# Altium schematic sheet supply1.SchDoc: foxBMS BMS-Master
size A3; DocumentNumber: 3; SheetNumber: 3; SheetTotal: 24; Author: Fraunhofer IISB foxBMS Team; REL-DATE: 2017-05-16; VERSION: 1.0.2; SheetDescription: Supply for MCU1 and peripherals
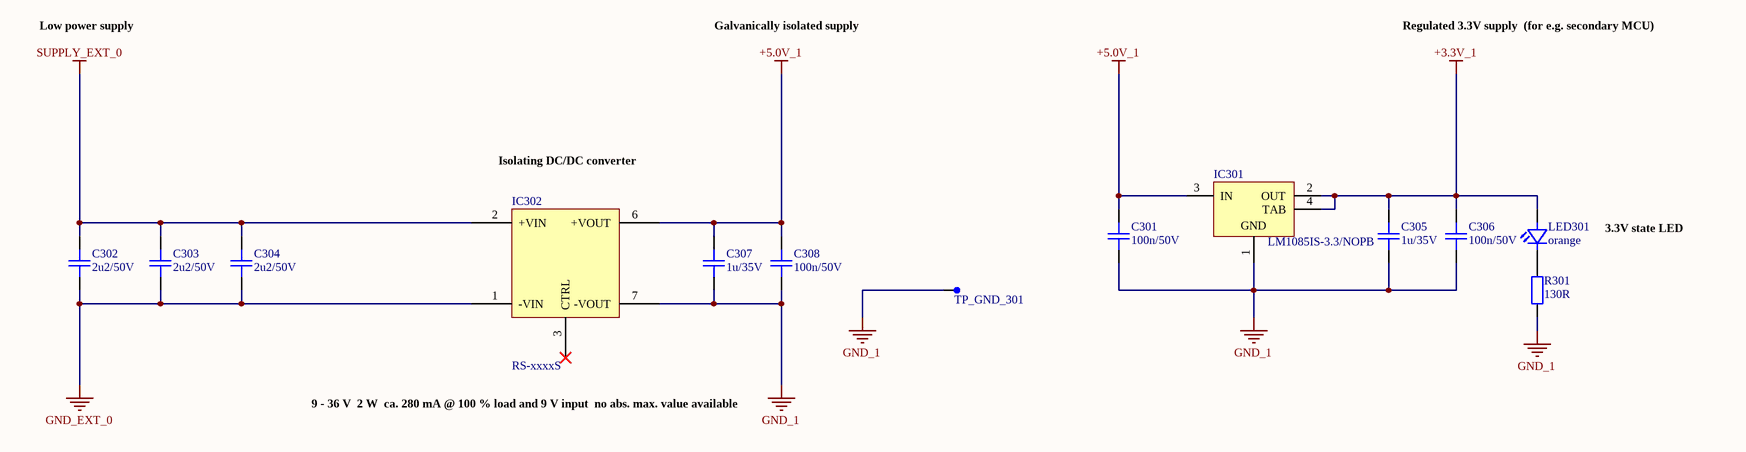
[diagram p0: supply1.SchDoc]

## Parts
C301  100n/50V  [CAPC1608X08N]
C302  2u2/50V  [CAPC2012X14N]
C303  2u2/50V  [CAPC2012X14N]
C304  2u2/50V  [CAPC2012X14N]
C305  1u/35V  [CAPC1608X08N]
C306  100n/50V  [CAPC1608X08N]
C307  1u/35V  [CAPC1608X08N]
C308  100n/50V  [CAPC1608X08N]
IC301  LM1085IS-3.3/NOPB  [KTT0003B_N]
IC302  RS-xxxxS  [RECOM_RS-S_D]
LED301  orange  [LEDC1608X07N]
R301  130R  [RESC1608X05N]
TP_GND_301  Testpoint_Round  [Testpoint_D1V]  (value not drawn)  (no BOM)

## Nets
+3.3V_1: C305.1 C306.1 IC301.2(OUT) IC301.4(TAB) LED301.2(A)
+5.0V_1: C301.1 C307.1 C308.1 IC301.3(IN) IC302.6(+VOUT)
GND_1: C301.2 C305.2 C306.2 C307.2 C308.2 IC301.1(GND) IC302.7(-VOUT) R301.2 TP_GND_301.1
GND_EXT_0: C302.2 C303.2 C304.2 IC302.1(-VIN)
SUPPLY_EXT_0: C302.1 C303.1 C304.1 IC302.2(+VIN)
NetLED301_1: LED301.1(C) R301.1

Not connected (* = marked no-connect by the designer): IC302 3(CTRL)*

## Notes on the sheet
- Low power supply
- Galvanically isolated supply
- Regulated 3.3V supply
  (for e.g. secondary MCU)
- Isolating DC/DC converter
- 3.3V state LED
- 9 - 36 V
  2 W
  ca. 280 mA @ 100 % load and 9 V input
  no abs. max. value available
- Fraunhofer IISB
- Schottkystr. 10
- developed by:
- 91058 Erlangen
- Germany
- Author
- Project
- License
- Description
- File
- Version
- Release Date
- Sheet
- www.foxbms.org
- www.iisb.fraunhofer.de
- foxBMS Team
- /

## Library data of the parts
C301 C306 C308 = gen_C_ceramic_100n_50V_X7R_0603: MLCC; Capacitance: 100n; Rated Voltage: 50V; Dielectric: X7R; Case EIA: 0603; Case Metric: 1608; PnP Package: C_0603_10; PnP Value: 100n/50V/X7R; PnP equipped: x; Automotive Qualified: False; Part Number: gen_C_ceramic_100n_50V_X7R_0603; Supplier 1: Farnell; Supplier Part Number 1: 2525267; Supplier 2: Digikey; Supplier Part Number 2: 490-6049-1-ND
C302-C304 = gen_C_ceramic_2u2_50V_X7R_0805: MLCC; Capacitance: 2u2; Rated Voltage: 50V; Dielectric: X7R; Case EIA: 0805; Case Metric: 2012; Automotive Qualified: False; Part Number: gen_C_ceramic_2u2_50V_X7R_0805; Supplier 1: Farnell; Supplier Part Number 1: 2547054
C305 C307 = gen_C_ceramic_1u_35V_X7R_0603: MLCC; Capacitance: 1u; Rated Voltage: 35V; Dielectric: X7R; Case EIA: 0603; Case Metric: 1608; PnP Package: C_0603_10; PnP Value: 1uF/35V/X7R; PnP equipped: x; Automotive Qualified: False; Part Number: gen_C_ceramic_1u_35V_X7R_0603; Supplier 1: Farnell; Supplier Part Number 1: 1907508
IC301 = CMP-0062-00578-5: 3A Low Dropout Positive Regulators, 3-pin TO-263, Pb-Free; Manufacturer: Texas Instruments; High-Reliability: Y; PowerWise: N; CompType: LDO IC; PackageTopMarking: NSUZXYTTE#*LM1085*IS-3.3; PartNumber: LM1085IS-3.3/NOPB; ComponentLink1Description: Datasheet URL; Code_JEDEC: MO-169-AA; PinCount: 3; RoHS: Y; PackageReference: KTT0003B; ComponentLink1URL: http://www.ti.com/general/docs/lit/getliterature.tsp?genericPartNumber=LM1085&fileType=pdf; PackageDescription: TO-263, Molded, .400 x .390 x .180in, 3 Lead, .1in Pitch, Surface Mount
IC302 = Recom_RS-2405SZ/H3: Isolating DC/DC Converter; Manufacturer: Recom; Automotive Qualified: False; Part Number: Recom_RS-2405SZ/H3; ComponentLink1Description: Datasheet; ComponentLink1URL: https://www.recom-power.com/pdf/Econoline/RS-S_D_Z.pdf; Supplier 1: Digikey; Supplier Part Number 1: 945-1552-5-ND; Supplier 2: Farnell; Supplier Part Number 2: 1893731; Supplier 3: Mouser; Supplier Part Number 3: 919-RS-2405SZ/H3
LED301 = gen_LED_0603_orange: LED; Breakdown Voltage: 5V; Continuous Forward Current: 20mA; Forward Voltage @ 20mA: 2.2V; Automotive Qualified: False; Part Number: gen_LED_0603_orange; Color: orange; PnP Package: LED_0603; Supplier 1: Farnell; Supplier Part Number 1: 2099222
R301 = gen_R_130R_0603: SMD Resistor 130R 0603; Tolerance: 1%; Power: 0.1W; Case EIA: 0603; Case Metric: 1608; Maximum Working Voltage: 75V; PnP Package: R_0603; Automotive Qualified: False; Part Number: gen_R_130R_0603; Operating Temperature: -55°C - +155°C; Resistance: 130R; Series: E24, E96; PnP Value: 130R; Supplier 1: Farnell; Supplier Part Number 1: 2379959
TP_GND_301 = Testpoint_Round_Via: Testpoint, Via, round; Part Number: Testpoint_Round_Via